# Altium project Carte_Herse_2020.PrjPcb
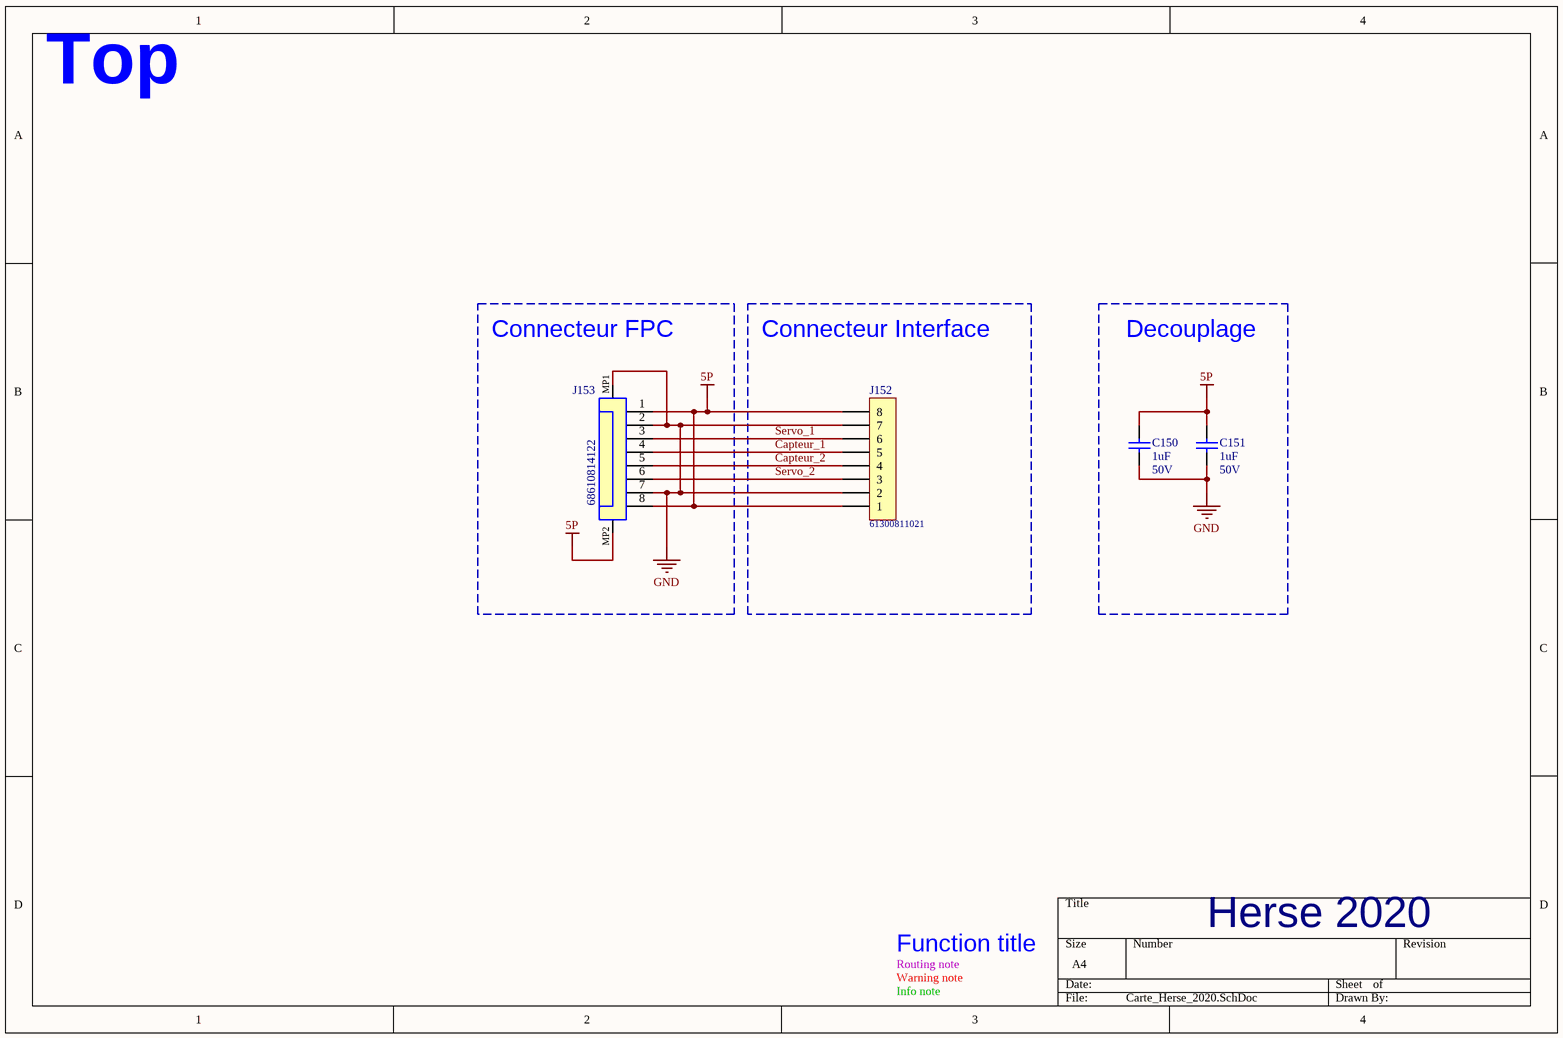
[diagram p0: Carte_Herse_2020.SchDoc]
1 sheet, 4 parts. Net scope: global (net labels, ports and power ports of the same name join across sheets).
Board file: Carte_Herse_2020-4L.PcbDoc

## Sheet Carte_Herse_2020.SchDoc
size A4; Author: Audran; CompanyName: Goldorak; Address1: Electrolab; Address2: 52 rue Paul Lescop; Address3: 92000 Nanterre; DocumentNumber: 1; SheetNumber: 1; SheetTotal: 5; ProjectName: Cartes_2017

### Parts
C150  1uF  RatedVoltage: 50V  [WCAP-CSGP_0805, 2x1.25x1.25]
C151  1uF  RatedVoltage: 50V  [WCAP-CSGP_0805, 2x1.25x1.25]
J152  61300811021  [61300811021]
J153  68610814122  [68610814122]

### Blocks framed on the sheet
Connecteur FPC: J153
Connecteur Interface: J152
Decouplage: C150 C151

### Nets
5P: C150.1 C151.1 J152.1 J152.8 J153.1 J153.8 J153.MP2
GND: C150.2 C151.2 J152.2 J152.7 J153.2 J153.7 J153.MP1
Capteur_1: J152.5 J153.4
Capteur_2: J152.4 J153.5
Servo_1: J152.6 J153.3
Servo_2: J152.3 J153.6

### Notes on the sheet
- Top
- Routing note
- Warning note
- Function title
- Herse 2020
- Info note

### Library data of the parts
C150 C151 = WCAP-CSGP, 885012207103: CAP CER 1uF 50V X7R 0805; Manufacturer: Wurth Elektronik; ComponentLink1Description: Datasheet; ComponentLink1URL: http://katalog.we-online.com/pbs/datasheet/885012207103.pdf; Manufacturer Part Number: 885012207103; Value: 1uF; Size: 0805; CeramicType: X7R; Supplier 2: JLCPCB; Supplier Part Number 2: C28323; Supplier Footprint 2: 0805
J152 = 61300811021: WR-PHD Header THT 2.54mm, Single Row, Angled, 8pin; Manufacturer: Wurth Electronics Inc.; Value: 8; ComponentLink1Description: Datasheet; ComponentLink1URL: https://www.we-online.com/catalog/datasheet/61300811021.pdf; Manufacturer Part Number: 61300811021; Supplier Part Number 1: 2356183; Supplier 1: Farnell
J153 = 68610814122: WR-FPC SMT ZIF Horizontal Top Contact, pitch 1mm, 8p; Manufacturer: Wurth Electronics Inc.; Value: 8; Manufacturer Part Number: 68610814122; ComponentLink1URL: https://www.we-online.com/catalog/datasheet/68610814122.pdf; ComponentLink1Description: Datasheet; Supplier 1: Farnell; Supplier Part Number 1: 1641905

## Assembly variants
PROD: not fitted J1